# EAGLE schematic LSM9DS1 breakout (EAGLE 9.0.0)
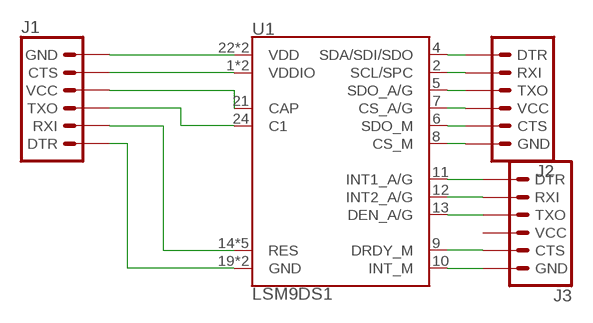
[diagram p0: schematic, sheet 1]

## Parts
J1  6_PIN_SERIAL_TARGET  [1X06]
J2  6_PIN_SERIAL_TARGET  [1X06]
J3  6_PIN_SERIAL_TARGET  [1X06]
U1  LSM9DS1  [LGA-24-3.5X3]

## Nets
N$1: J1.6(GND) U1.22(VDD) U1.23(VDD)
N$2: J1.5(CTS) U1.1(VDDIO) U1.3(VDDIO)
N$3: J1.4(VCC) U1.21(CAP)
N$4: J1.3(TXO) U1.24(C1)
N$5: J1.2(RXI) U1.14(RES) U1.15(RES) U1.16(RES) U1.17(RES) U1.18(RES)
N$6: J1.1(DTR) U1.19(GND) U1.20(GND)
N$7: J3.6(GND) U1.10(INT_M)
N$8: J3.5(CTS) U1.9(DRDY_M)
N$9: J3.3(TXO) U1.13(DEN_A/G)
N$10: J3.2(RXI) U1.12(INT2_A/G)
N$11: J3.1(DTR) U1.11(INT1_A/G)
N$12: J2.6(GND) U1.8(CS_M)
N$13: J2.5(CTS) U1.6(SDO_M)
N$14: J2.4(VCC) U1.7(CS_A/G)
N$15: J2.3(TXO) U1.5(SDO_A/G)
N$16: J2.2(RXI) U1.2(SCL/SPC)
N$17: J2.1(DTR) U1.4(SDA/SDI/SDO)
Unconnected: J3.4(VCC)

## Library data of the parts
J1-J3 = SparkFun-Connectors:6_PIN_SERIAL_TARGET: 6-pin header connection for use with the "FTDI BASIC" pinout - TARGET SIDE. Also known as "Arduino Serial Program Header". It is used to mate with our FTDI Basic serial programmers using the Arduino IDE. Note, this device has "TARGET" in the name. It is intended to be used on a design that contains a target micro-controller that you wish to program. The "sister" device, named "CABLE" is inteneded to be used on a design that usually lives on the end of your USB cable and prvides the converter chip (FTDI232 or FTDI231x) to commnicate serial RX/TX. You can populate with some of these: Break Away Headers - Straight <https://www.sparkfun.com/products/116> (PRT-00116) For reference (or to suit your programming needs) check out these designs: SparkFun FTDI Basic Breakout - 5V <https://www.sparkfun.com/products/9716> (DEV-09716) SparkFun FTDI Basic Breakout - 3.3V <https://www.sparkfun.com/products/9873> (DEV-09873) SparkFun FTDI SmartBasic <https://www.sparkfun.com/products/12935> (DEV-12935) SparkFun Beefy 3 - FTDI Basic Breakout <https://www.sparkfun.com/products/13746> (DEV-13746)
U1 = SparkFun-Sensors:LSM9DS1: ST Microelectronics LSM9DS1 9DOF IMU - Accelerometer, Gyroscope & Magnetometer The LSM9DS1 is a versatile, motion-sensing system-in-a-chip. It houses a 3-axis accelerometer, 3-axis gyroscope, and 3-axis magnetometer – nine degrees of freedom (9DOF) in a single IC! The LSM9DS1 is equipped with a digital interface, but even that is flexible: it supports both I2C and SPI, so you’ll be hard-pressed to find a microcontroller it doesn’t work with. Datasheet <https://cdn.sparkfun.com/assets/learn_tutorials/3/7/3/LSM9DS1_Datasheet.pdf> SparkFun Products SparkFun 9 Degrees of Freedom IMU Breakout - LSM9DS1 <https://www.sparkfun.com/products/13284> (SEN-13284) SparkFun Photon IMU Shield <https://www.sparkfun.com/products/13629> (DEV-13629); PROD_ID: IC-12536